# EAGLE design MAX44008_Breakout (EAGLE 6.4)
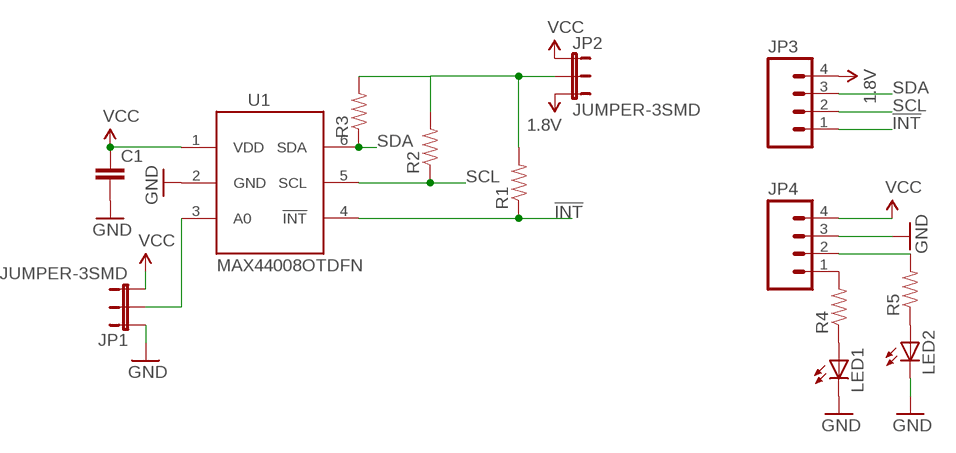
[diagram p0: schematic, sheet 1]

## Parts
C1  CAP0603-CAP  [0603-CAP]
JP1  JUMPER-3SMD  [SJ_3]
JP2  JUMPER-3SMD  [SJ_3]
JP3  M04PTH  [1X04]
JP4  M04PTH  [1X04]
LED1  LED0603  [LED-0603]
LED2  LED0603  [LED-0603]
R1  RESISTOR0603-RES  [0603-RES]
R2  RESISTOR0603-RES  [0603-RES]
R3  RESISTOR0603-RES  [0603-RES]
R4  RESISTOR0603-RES  [0603-RES]
R5  RESISTOR0603-RES  [0603-RES]
U1  MAX44008OTDFN  [MAX44008]

## Nets
1.8V: JP2.3 JP3.4
!INT: JP3.1 R1.1 U1.4(!INT)
GND: C1.2 JP1.1 JP4.3 LED1.C LED2.C U1.2(GND)
N$1: LED1.A R4.1
N$2: LED2.A R5.1
N$5: JP1.2 U1.3(A0)
N$6: JP2.2 R1.2 R2.2 R3.2
N$12: JP4.2 R5.2
N$13: JP4.1 R4.2
SCL: JP3.2 R2.1 U1.5(SCL)
SDA: JP3.3 R3.1 U1.6(SDA)
VCC: C1.1 JP1.3 JP2.1 JP4.4 U1.1(VDD)

## Library data of the parts
C1 = SparkFun-Passives:CAP: Capacitor Standard 0603 ceramic capacitor, and 0.1" leaded capacitor.
JP1 JP2 = SparkFun-Passives:JUMPER-3
JP3 JP4 = SparkFun-Connectors:M04: Header 4 Standard 4-pin 0.1" header. Use with straight break away headers (SKU : PRT-00116), right angle break away headers (PRT-00553), swiss pins (PRT-00743), machine pins (PRT-00117), and female headers (PRT-00115). Molex polarized connector foot print use with SKU : PRT-08231 with associated crimp pins and housings. 1MM SMD Version SKU: PRT-10208
LED1 LED2 = SparkFun-LED:LED: LEDs Standard schematic elements and footprints for 5mm, 3mm, 1206, and 0603 sized LEDs. 5mm - Spark Fun Electronics SKU : COM-00529 (and others)
R1-R5 = SparkFun-Passives:RESISTOR: Resistor Basic schematic elements and footprints for 0603, 1206, and PTH resistors.
U1 = maxim-optical-sensor:MAX44008

## Board
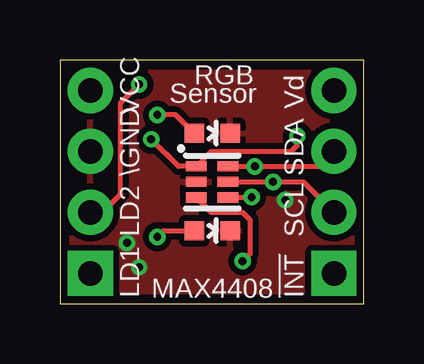
[diagram p1: board, top side]
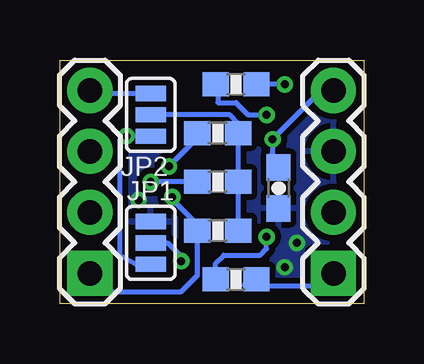
[diagram p2: board, bottom side, seen from below]

Size 12.68 x 10.16 mm. Coordinates in mm from the lower left corner, seen from the top.
Outline: 0,0 12.68,0 12.68,10.16 0,10.16 0,0
Copper layers (1*16): Top 0.0356mm / dielectric 1.5011mm / Bottom 0.0356mm
Design rules "LaenPCBOrder": minimum track width 6mil, minimum drill 13mil, track to track 6mil, track to pad 6mil, pad to pad 6mil, via to via 6mil, smd to smd 6mil, copper to edge 15mil, drill to drill 6mil, minimum pad ring 7mil, minimum via ring 7mil, stop-mask expansion 4mil, vias tented up to drill 13mil, thermal gap 10mil

### Footprints (pad centres in the part's own frame; a part is rotated, then mirrored left to right if it is on the bottom)
0603-CAP = smd 1.1 x 1: 1 -0.85,0; 2 0.85,0
SJ_3 = smd 0.635 x 1.27: 1 -0.889,0; 2 0,0; 3 0.889,0
1X04 = drill 1.016 pad 1.88 square: 1 0,0 | drill 1.016 pad 1.88: 2 2.54,0; 3 5.08,0; 4 7.62,0
LED-0603 = smd 0.8 x 0.8: A 0,-0.75; C 0,0.75
0603-RES = smd 1.1 x 1: 1 -0.85,0; 2 0.85,0
MAX44008 = smd 0.86 x 0.42: 1 -0.66,0.65; 2 -0.66,0; 3 -0.66,-0.65; 4 0.66,-0.65; 5 0.66,0; 6 0.66,0.65

### Placement (x,y rotation side)
C1  3.56,4.83 270 bottom
JP1  8.89,2.54 270 bottom
JP2  8.89,7.87 90 bottom
JP3  11.43,1.27 90 bottom
JP4  1.27,1.27 90 bottom
LED1  6.35,3.05 270 top
LED2  6.35,7.11 270 top
R1  6.1,3.05 0 bottom
R2  6.1,5.08 0 bottom
R3  6.1,7.11 0 bottom
R4  5.33,1.02 0 bottom
R5  5.33,9.14 0 bottom
U1  6.35,5.08 0 top

### Tracks (layer width: path | path; a pad name or v marks a point on that pad's centre or on a via)
1.8V
  Bottom 0.203: JP2.3 11.3,8.76 JP3.4
!INT  (via drill 0.33)
  Top 0.203: U1.4 7.12,4.32 7.25,4.45 v8,4.45
  Bottom 0.203: R1.1 6.99,3.34 8,4.36 v8,4.45 | 7.11,3.05 R1.1 | R1.1 6.95,1.18 7.62,0.51 10.67,0.51 JP3.1
GND  (via drill 0.33)
  other vias: 9.4,4.32 2.79,2.54 3.3,1.52
  pour Top (isolate 0.254): 0,0 0,10.16 12.7,10.16 12.7,0
  pour Bottom (isolate 0.254): 0,0 0,10.16 12.7,10.16 12.7,0
N$1  (via drill 0.33)
  Top 0.203: v4.06,2.79 4.32,3.05 LED1.A
  Bottom 0.203: R4.1 6.18,1.69 5.84,2.03 4.32,2.03 4.06,2.29 v4.06,2.79
N$2  (via drill 0.33)
  Top 0.203: LED2.A 5.59,7.12 5.59,7.11 4.83,7.87 v4.06,7.87
  Bottom 0.203: R5.1 6.1,9.06 6.1,8.38 5.33,8.38 4.83,7.87 v4.06,7.87
N$5  (via drill 0.33)
  Top 0.203: U1.3 6.31,3.81 7.62,3.81 7.93,3.5 7.93,2.09 v7.62,1.78
  Bottom 0.203: JP1.2 8.19,2.54 7.62,1.97 v7.62,1.78
N$6
  Bottom 0.203: R1.2 R2.2 R3.2 5.25,7.53 5.59,7.87 JP2.2
N$12  (via drill 0.33)
  Top 0.203: v3.3,9.14 2.54,8.38 2.54,4.57 1.78,3.81 JP4.2
  Bottom 0.203: v3.3,9.14 R5.2
N$13
  Bottom 0.203: R4.2 arc-90 4.99,0.76 1.78,0.76 JP4.1
SCL  (via drill 0.33)
  Top 0.203: U1.5 v8.89,5.08 10.16,5.08 JP3.2
  Bottom 0.203: R2.1 v8.89,5.08
SDA  (via drill 0.33)
  Top 0.203: U1.6 v8.13,5.73 10.81,5.73 JP3.3
  Bottom 0.203: R3.1 6.95,6.91 v8.13,5.73
VCC  (via drill 0.33)
  Top 0.203: v3.81,6.86 4.94,5.73 U1.1 6.31,6.35 9.65,6.35 9.91,6.6 v9.91,6.99
  Bottom 0.203: C1.1 3.98,6.1 3.81,6.26 v3.81,6.86 1.78,8.89 JP4.4 | JP1.3 9.53,1.65 10.16,2.03 10.16,6.86 10.03,6.99 v9.91,6.99 JP2.1

### Text on the board
tPlace: RGB | VCC | Sensor | Vd | \GND | SDA | LD2 | SCL | LD1 | MAX4408 | !INT